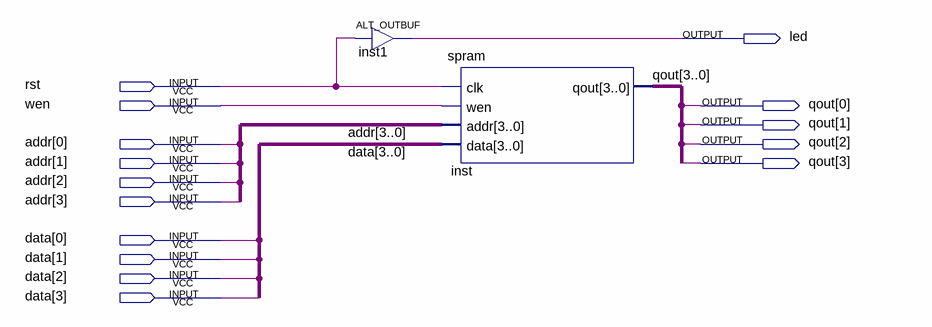
[diagram p0: schematic sheet]
// Quartus schematic dig2lab2.bdf as structural Verilog: 2 symbols, 15 pins
module dig2lab2 (
  input  rst,
  input  wen,
  input  [3:0] addr,
  input  [3:0] data,
  output led,
  output [3:0] qout
);

  ALT_OUTBUF inst1 (.i(rst), .o(led));
  spram inst (.clk(rst), .wen(wen), .addr(addr), .data(data), .qout(qout));
endmodule
